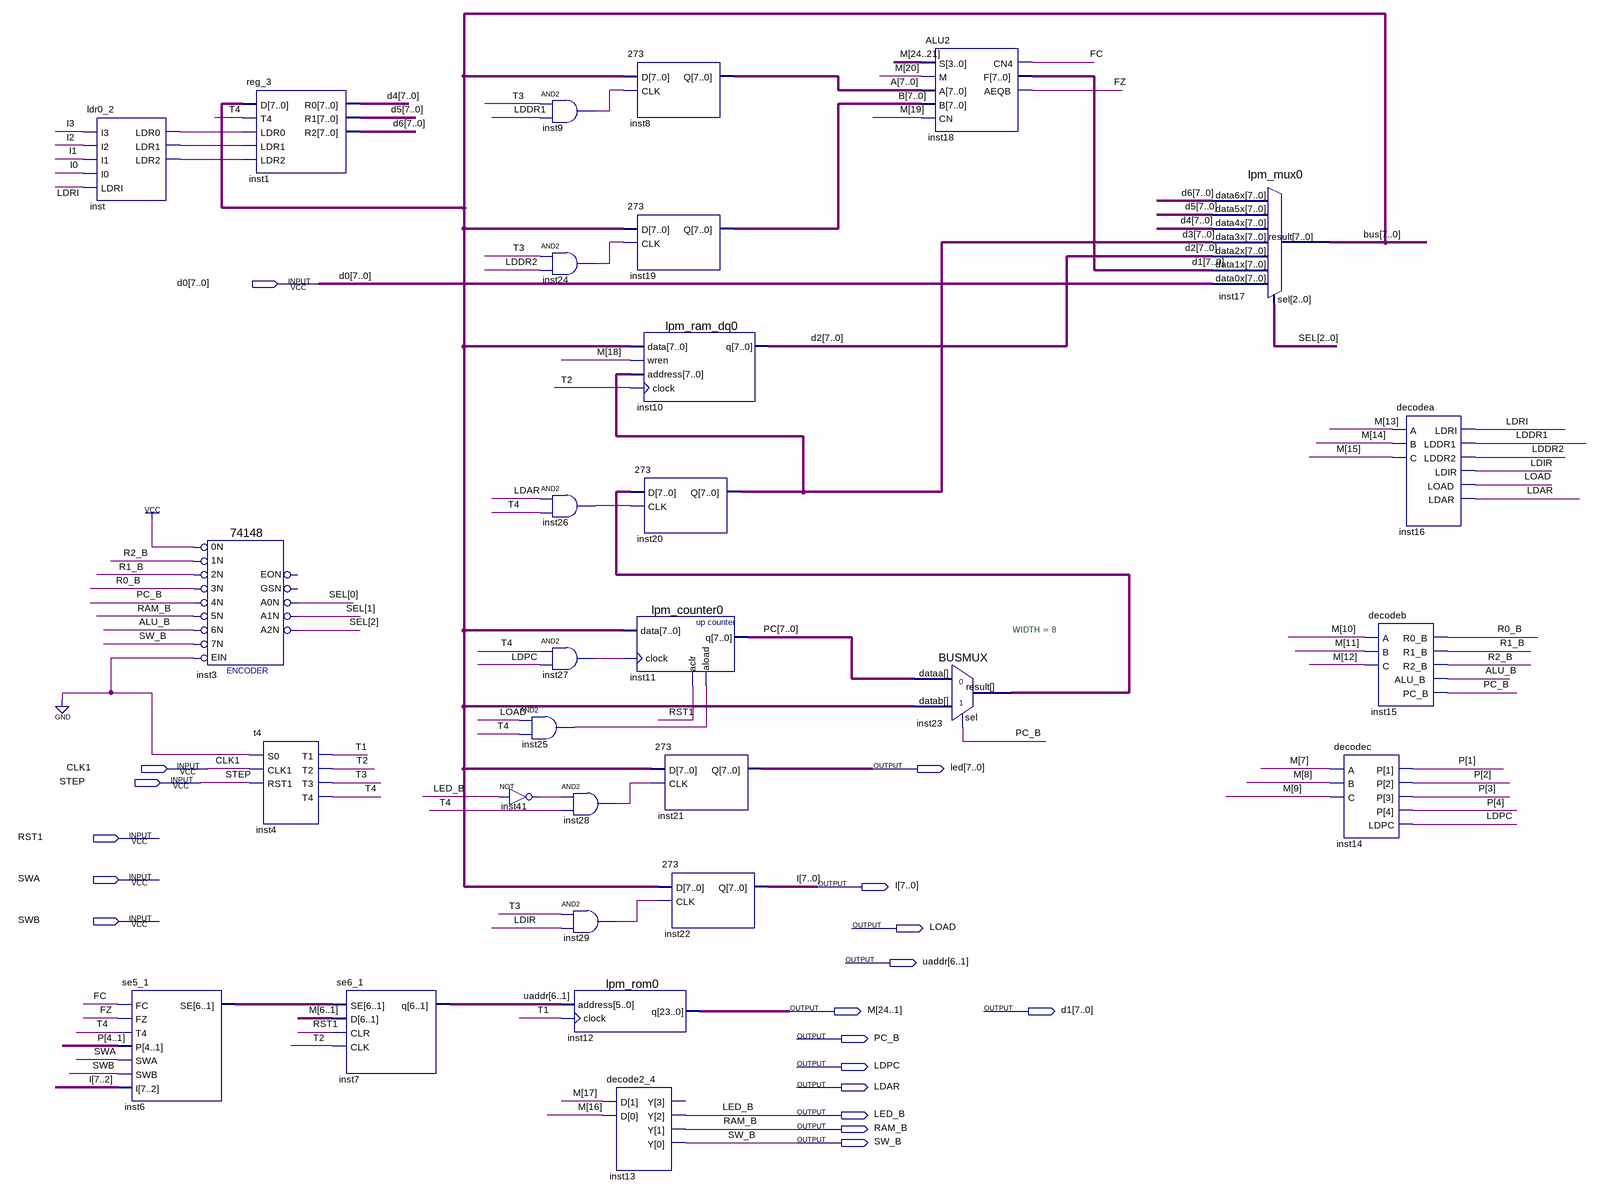
[diagram p0: schematic sheet]
// Quartus schematic jzsx.bdf as structural Verilog: 29 symbols, 18 pins
module jzsx (
  input  [7:0] d0,
  input  CLK1,
  input  STEP,
  input  RST1,
  input  SWA,
  input  SWB,
  output [7:0] led,
  output [7:0] I,
  output LOAD,
  output [6:1] uaddr,
  output [24:1] M,
  output [7:0] d1,
  output PC_B,
  output LDPC,
  output LDAR,
  output LED_B,
  output RAM_B,
  output SW_B
);

  wire ALU_B, FC, FZ, inst9_out, inst24_out, inst25_out, inst26_out, inst27_out, inst28_out, inst29_out,
       inst41_out, inst_ldr0, inst_ldr1, inst_ldr2, LDDR1, LDDR2, LDIR, LDRI, R0_B, R1_B, R2_B, T1, T2, T3,
       T4;
  wire [2:0] SEL;
  wire [4:1] P;
  wire [5:0] inst6_se;
  wire [7:0] A, B, bus, d2, d3, d4, d5, d6, inst23_result, PC;
  wire [3:0] inst13_y_open;  // unused outputs

  ldr0_2 inst (
    .I3(I[3]), .I2(I[2]), .I1(I[1]), .I0(I[0]), .LDRI(LDRI), .LDR0(inst_ldr0), .LDR1(inst_ldr1),
    .LDR2(inst_ldr2));
  se5_1 inst6 (.FC(FC), .FZ(FZ), .T4(T4), .P(P), .SWA(SWA), .SWB(SWB), .I(I[7:2]), .SE(inst6_se));
  \74148  inst3 (
    .\5N (RAM_B), .\0N (1'b1), .\1N (R2_B), .\2N (R1_B), .\3N (R0_B), .\4N (PC_B), .EIN(1'b0), .\6N (ALU_B),
    .\7N (SW_B), .A1N(SEL[1]), .A0N(SEL[0]), .A2N(SEL[2]));  // open: EON, GSN
  reg_3 inst1 (.D(bus), .T4(T4), .LDR0(inst_ldr0), .LDR1(inst_ldr1), .LDR2(inst_ldr2), .R0(d4), .R1(d5), .R2(d6));
  t4 inst4 (.S0(1'b0), .CLK1(CLK1), .RST1(STEP), .T1(T1), .T2(T2), .T3(T3), .T4(T4));
  se6_1 inst7 (.SE(inst6_se), .D(M[6:1]), .CLR(RST1), .CLK(T2), .q(uaddr));
  and inst25 (inst25_out, LOAD, T4);
  not inst41 (inst41_out, LED_B);
  and inst9 (inst9_out, T3, LDDR1);
  and inst24 (inst24_out, T3, LDDR2);
  and inst26 (inst26_out, LDAR, T4);
  and inst27 (inst27_out, T4, LDPC);
  and inst28 (inst28_out, inst41_out, T4);
  and inst29 (inst29_out, T3, LDIR);
  lpm_rom0 inst12 (.address(uaddr), .clock(T1), .q(M));
  \273  inst8 (.D(bus), .CLK(inst9_out), .Q(A));
  \273  inst19 (.D(bus), .CLK(inst24_out), .Q(B));
  lpm_ram_dq0 inst10 (.data(bus), .wren(M[18]), .address(d3), .clock(T2), .q(d2));
  \273  inst20 (.D(inst23_result), .CLK(inst26_out), .Q(d3));
  lpm_counter0 inst11 (.data(bus), .clock(inst27_out), .aclr(RST1), .aload(inst25_out), .q(PC));
  decode2_4 inst13 (.D(M[17:16]), .Y({inst13_y_open[3], LED_B, RAM_B, SW_B}));
  \273  inst21 (.D(bus), .CLK(inst28_out), .Q(led));
  \273  inst22 (.D(bus), .CLK(inst29_out), .Q(I));
  BUSMUX #(.WIDTH(8)) inst23 (.datab(bus), .sel(PC_B), .dataa(PC), .result(inst23_result));
  ALU2 inst18 (.S(M[24:21]), .M(M[20]), .A(A), .B(B), .CN(M[19]), .CN4(FC), .F(d1), .AEQB(FZ));
  lpm_mux0 inst17 (
    .data6x(d6), .data5x(d5), .data4x(d4), .data3x(d3), .data2x(d2), .data1x(d1), .data0x(d0), .sel(SEL),
    .result(bus));
  decodec inst14 (.A(M[7]), .B(M[8]), .C(M[9]), .P(P), .LDPC(LDPC));
  decodea inst16 (
    .A(M[13]), .B(M[14]), .C(M[15]), .LDRI(LDRI), .LDDR1(LDDR1), .LDDR2(LDDR2), .LDIR(LDIR), .LOAD(LOAD),
    .LDAR(LDAR));
  decodeb inst15 (.A(M[10]), .B(M[11]), .C(M[12]), .R0_B(R0_B), .R1_B(R1_B), .R2_B(R2_B), .ALU_B(ALU_B), .PC_B(PC_B));
endmodule
